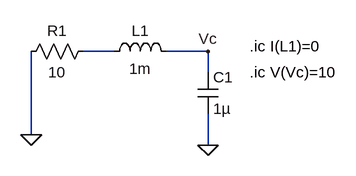
[diagram p0: schematic RLC_sourceFree_with_cap_initial_condition.asc]
RLC_sourceFree_with_cap_initial_condition.asc, the LTspice schematic file:
Version 4
SHEET 1 880 680
WIRE 128 144 80 144
WIRE 272 144 208 144
WIRE 272 176 272 144
WIRE 0 272 0 144
WIRE 272 288 272 240
FLAG 272 288 0
FLAG 0 272 0
FLAG 272 144 Vc
SYMBOL res 96 128 R90
WINDOW 0 0 56 VBottom 2
WINDOW 3 32 56 VTop 2
SYMATTR InstName R1
SYMATTR Value 10
SYMBOL ind 112 160 R270
WINDOW 0 32 56 VTop 2
WINDOW 3 5 56 VBottom 2
SYMATTR InstName L1
SYMATTR Value 1m
SYMBOL cap 256 176 R0
SYMATTR InstName C1
SYMATTR Value 1µ
TEXT 336 136 Left 2 !.ic I(L1)=0
TEXT 336 176 Left 2 !.ic V(Vc)=10

The netlist it stands for:
* RLC_sourceFree_with_cap_initial_condition.asc
R1 N001 0 10
L1 N001 Vc 1m
C1 Vc 0 1µ
.ic I(L1)=0
.ic V(Vc)=10
.backanno
.end